# EAGLE design Grove - Joint v2.0 (EAGLE 7.1.0)
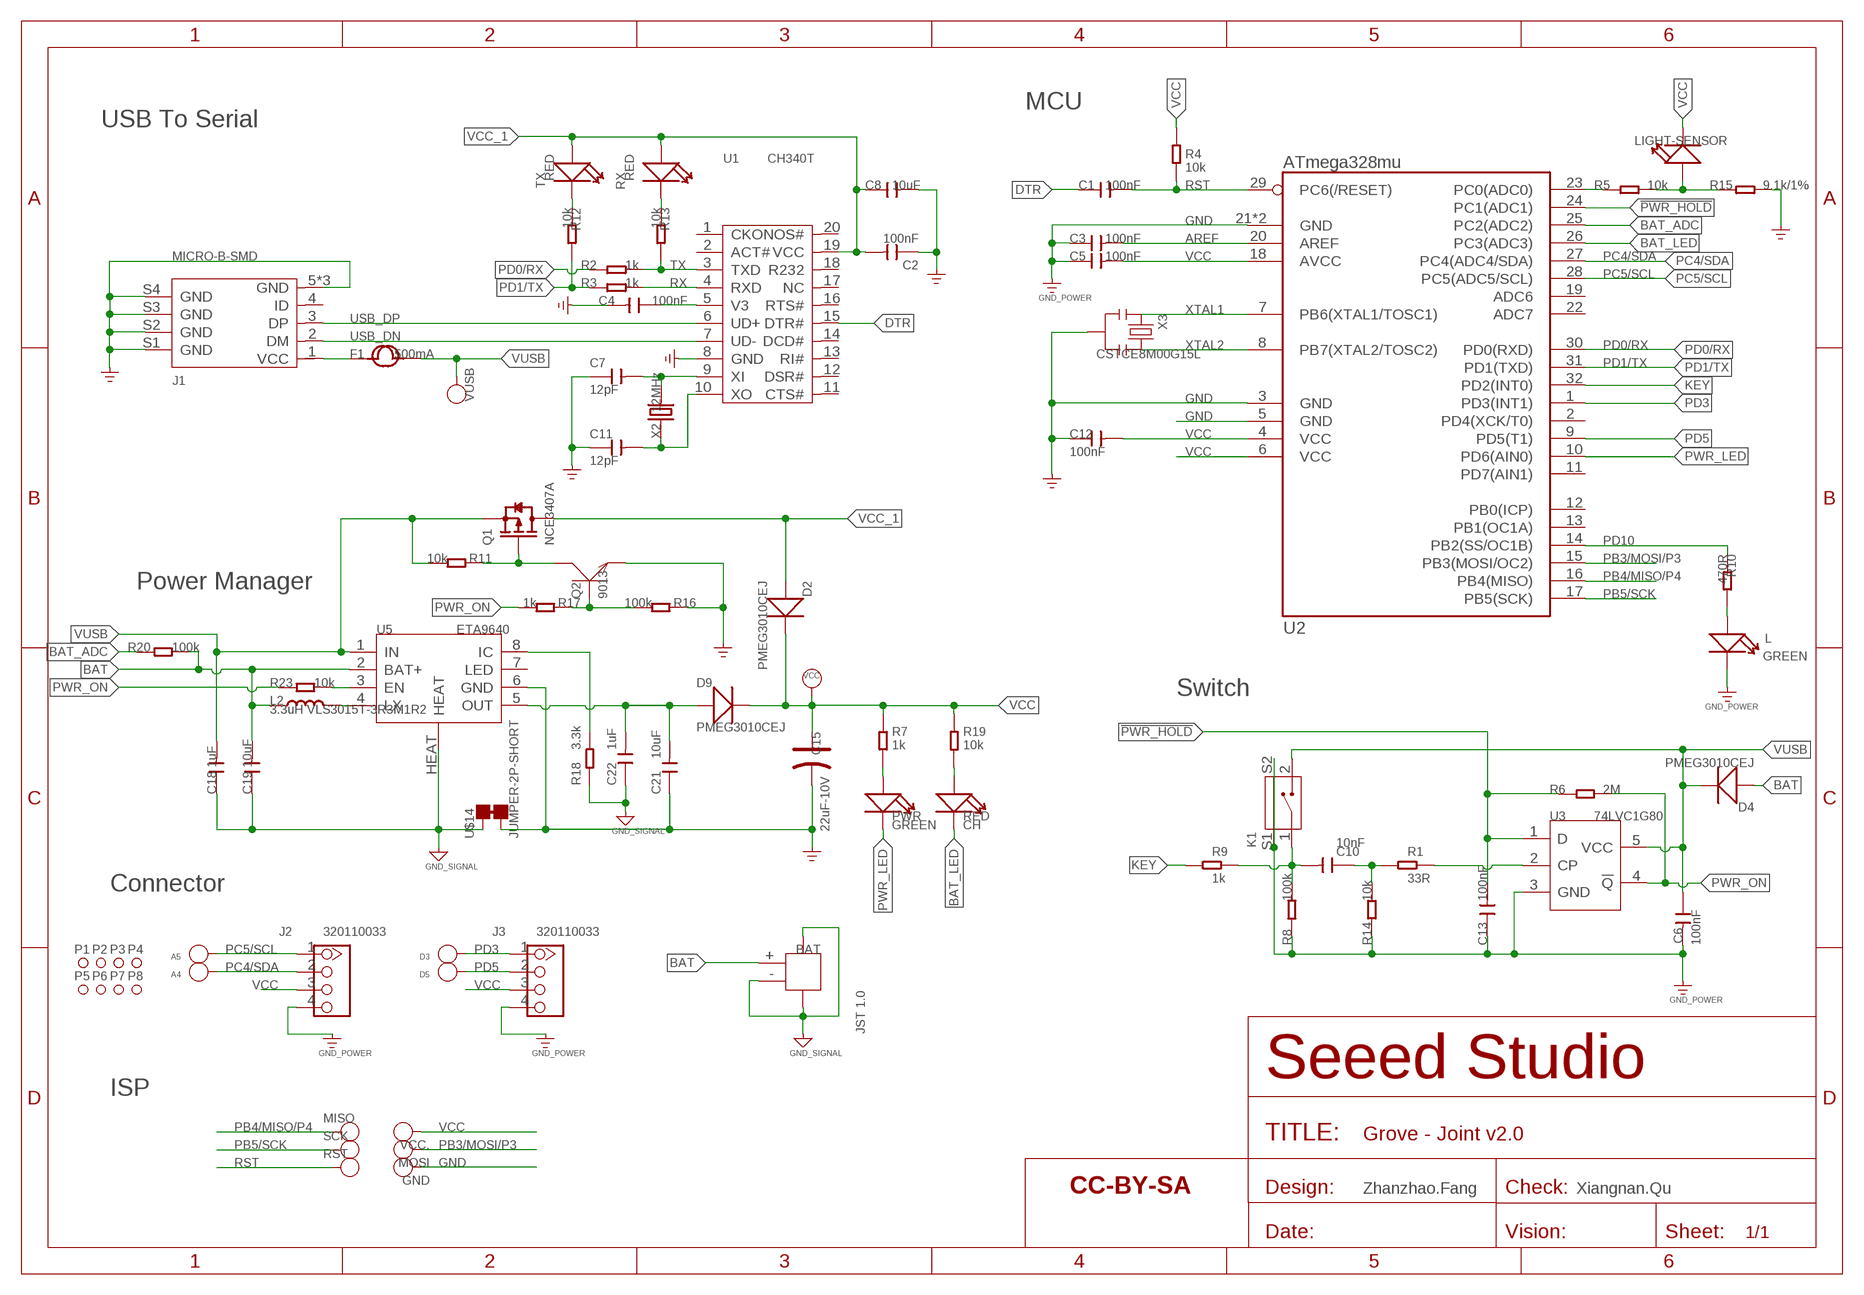
[diagram p0: schematic, sheet 1]

## Parts
A4  DNP  PAD-TEST-POINT'4545'  [TP_4545]
A5  DNP  PAD-TEST-POINT'4545'  [TP_4545]
BAT  JST 1.0  JST-2P-SMD'1.0'  [2P-SMD-1.0]
C1  100nF  CAP-0402  [C0402]
C2  100nF  CAP-0402  [C0402]
C3  100nF  CAP-0402  [C0402]
C4  100nF  CAP-0402  [C0402]
C5  100nF  CAP-0402  [C0402]
C6  100nF  CAP-0402  [C0402]
C7  12pF  CAP-0402  [C0402]
C8  10uF  CAP-0805  [C0805]
C10  10nF  CAP-0402  [C0402]
C11  12pF  CAP-0402  [C0402]
C12  100nF  CAP-0402  [C0402]
C13  100nF  CAP-0402  [C0402]
C15  22uF-10V  CAP-POLAR-AVX-A  [AVX-A]
C18  1uF  CAP-0805  [C0805]
C19  10uF  CAP-0805  [C0805]
C21  10uF  CAP-0805  [C0805]
C22  1uF  CAP-0603  [C0603]
CH  RED  LED'0402'  [LED-0402]
D2  PMEG3010CEJ  DIODE'0805'  [SOD-323]
D3  DNP  PAD-TEST-POINT'4545'  [TP-D45MIL]
D4  PMEG3010CEJ  DIODE'0805'  [SOD-323]
D5  DNP  PAD-TEST-POINT'4545'  [TP_4545]
D9  PMEG3010CEJ  DIODE'0805'  [SOD-323]
F1  500mA  FUSE'1206'  [F1206]
GND  DNP  PAD-TEST-POINT'4545'  [TP-D45MIL]
J1  MICRO-B-SMD  USB-MICRO-5P'5+4P'  [5+4P-SMD-0.65-B]
J2  320110033  GROVE-CONNECTOR-DIP-2.0  [4P-2.0]
J3  320110033  GROVE-CONNECTOR-DIP-2.0  [4P-2.0]
K1  311020023  BUTTON-2+2P'TS-1188E'  [4P-SMD-L7.0*W3.5*H3.5MM-90D]
L  GREEN  LED'0402'  [LED-0402]
L2  3.3uH VLS3015T-3R3M1R2  L'SLW3015S220MST'  [L3015]
LIGHT-SENSOR  light_sensor  LED'0805'  [LED-0805]
MISO  DNP  PAD-TEST-POINT'4545'  [TP-D45MIL]
MOSI  DNP  PAD-TEST-POINT'4545'  [TP-D45MIL]
P1  PAD-MARK'ANNULAR'  [ROUND-MARK-1.0]
P2  PAD-MARK'ANNULAR'  [ROUND-MARK-1.0]
P3  PAD-MARK'ANNULAR'  [ROUND-MARK-1.0]
P4  PAD-MARK'ANNULAR'  [ROUND-MARK-1.0]
P5  PAD-MARK'ANNULAR'  [ROUND-MARK-1.0]
P6  PAD-MARK'ANNULAR'  [ROUND-MARK-1.0]
P7  PAD-MARK'ANNULAR'  [ROUND-MARK-1.0]
P8  PAD-MARK'ANNULAR'  [ROUND-MARK-1.0]
PWR  GREEN  LED'0402'  [LED-0402]
Q1  NCE3407A  MOSFET-P'SI2323CDS/SI2305DS<BR>'  [SOT-23]
Q2  9013  TRANSISTOR-NPN-SOT323  [SOT-323]
R1  33R  RES-0402  [R0402]
R2  1k  RES-0402  [R0402]
R3  1k  RES-0402  [R0402]
R4  10k  RES-0402  [R0402]
R5  10k  RES-0402  [R0402]
R6  2M  RES-0402  [R0402]
R7  1k  RES-0402  [R0402]
R8  100k  RES-0402  [R0402]
R9  1k  RES-0402  [R0402]
R10  470R  RES-0402  [R0402]
R11  10k  RES-0402  [R0402]
R12  10k  RES-0402  [R0402]
R13  10k  RES-0402  [R0402]
R14  10k  RES-0402  [R0402]
R15  9.1k/1%  RES-0402  [R0402]
R16  100k  RES-0402  [R0402]
R17  1k  RES-0402  [R0402]
R18  3.3k  RES-0402  [R0402]
R19  10k  RES-0402  [R0402]
R20  100k  RES-0402  [R0402]
R23  10k  RES-0402  [R0402]
RST  DNP  PAD-TEST-POINT'4545'  [TP-D45MIL]
RX  RED  LED'0402'  [LED-0402]
SCK  DNP  PAD-TEST-POINT'4545'  [TP-D45MIL]
TX  RED  LED'0402'  [LED-0402]
U1  CH340T  [SSOP20]
U2  ATmega328mu  ATMEGA8/168/328MLF  [MLF32X-W/HEAT]
U3  74LVC1G80  [SOT-753]
U5  ETA9640  [SOP8-W/HEAT]
U$4  SEEEDSTUDIO-OPEN-SCH-FRAME  [SEEEDSTUDIO-PCB-FRAME]
U$14  JUMPER-2P-SHORT  [2P-SMD-SHORT]
VCC  NC  PAD-TEST-POINT'4545'  [TP-D45MIL]
VCC.  NC  PAD-TEST-POINT'4545'  [TP-D45MIL]
VUSB  PAD-TEST-POINT'4545'  [TP-D45MIL]
X2  12MHz  CRYSTAL'5032'  [2P-SMD-L5.0XW3.2MM]
X3  CSTCE8M00G15L  CRYSTAL-RESONATOR'SMD'  [3P-SMD-L3.6*W1.3MM]

## Nets
!PWR_HOLD: C13.2 R6.1 U2.24(PC1(ADC1)) U3.1(D)
AGND: BAT.3 BAT.4 BAT.- C18.1 C19.1 C22.1 R18.2 U5.HEAT U$14.1 ; supply symbol labelled GND_SIGNAL
AREF: C3.2 U2.20(AREF)
BAT: BAT.+ C19.2 D4.+ L2.1 R20.2 U5.2(BAT+)
BAT_ADC: R20.1 U2.25(PC2(ADC2))
BAT_LED: CH.- U2.26(PC3(ADC3))
BOOST: C21.2 C22.2 D9.+ U5.5(OUT)
DTR: C1.1 U1.15(DTR#)
GND: C2.1 C3.1 C4.2 C5.1 C6.2 C7.1 C8.2 C11.1 C12.1 C13.1 C15.- C21.1 GND.T J1.5(GND) J1.S1(GND) J1.S2(GND) J1.S3(GND) J1.S4(GND) J1.S5(GND) J1.S6(GND) J2.4 J3.4 K1.S1 K1.S2 L.- Q2.2(E) R8.1 R14.1 R15.2 R16.2 U1.8(GND) U2.3(GND) U2.5(GND) U2.21(GND) U2.HEAT(GND) U3.3(GND) U5.6(GND) U$14.2 X3.2 ; supply symbol labelled GND_POWER
KEY: R9.1 U2.32(PD2(INT0))
N$1: C10.1 R1.1 R14.2
N$2: L.+ R10.2
N$3: LIGHT-SENSOR.+ R5.2 R15.1
N$4: CH.+ R19.1
N$5: C10.2 K1.1 R8.2 R9.2
N$6: R5.1 U2.23(PC0(ADC0))
N$7: R23.2 U5.3(EN)
N$8: R12.1 TX.-
N$9: R13.1 RX.-
N$10: C7.2 U1.9(XI) X2.2
N$11: R1.2 U3.2(CP)
N$12: Q1.1(G) Q2.3(C) R11.2
N$13: PWR.+ R7.2
N$14: C11.2 U1.10(XO) X2.1
N$15: Q2.1(B) R16.1 R17.2
N$16: R18.1 U5.8(IC)
N$17 [usbvcc]: F1.1 J1.1(VCC)
N$20: L2.2 U5.4(LX)
PB3/MOSI/P3: MOSI.T U2.15(PB3(MOSI/OC2))
PB4/MISO/P4: MISO.T U2.16(PB4(MISO))
PB5/SCK: SCK.T U2.17(PB5(SCK))
PC4/SDA: A4.T J2.2 U2.27(PC4(ADC4/SDA))
PC5/SCL: A5.T J2.1 U2.28(PC5(ADC5/SCL))
PD0/RX: R2.1 U2.30(PD0(RXD))
PD1/TX: R3.1 R12.2 U2.31(PD1(TXD))
PD3: D3.T J3.1 U2.1(PD3(INT1))
PD5: D5.T J3.2 U2.9(PD5(T1))
PD10: R10.1 U2.14(PB2(SS/OC1B))
PWR_LED: PWR.- U2.10(PD6(AIN0))
PWR_ON: R6.2 R17.1 R23.1 U3.4(!Q)
RST: C1.2 R4.1 RST.T U2.29(PC6(/RESET))
RX: R3.2 U1.4(RXD)
TX: R2.2 R13.2 U1.3(TXD)
USB_DN: J1.2(DM) U1.7(UD-)
USB_DP: J1.3(DP) U1.6(UD+)
V3: C4.1 U1.5(V3)
VCC: C5.2 C12.2 C15.+ D2.- D9.- J2.3 J3.3 LIGHT-SENSOR.- R4.2 R7.1 R19.2 U2.4(VCC) U2.6(VCC) U2.18(AVCC) VCC..T VCC.T
VCC_1: C2.2 C8.1 D2.+ Q1.3(D) RX.+ TX.+ U1.19(VCC)
VUSB: C6.1 C18.2 D4.- F1.2 K1.2 Q1.2(S) R11.1 U3.5(VCC) U5.1(IN) VUSB.T
XTAL1: U2.7(PB6(XTAL1/TOSC1)) X3.1
XTAL2: U2.8(PB7(XTAL2/TOSC2)) X3.3
Unconnected: J1.4(ID) U1.1(CKO) U1.2(ACT#) U1.11(CTS#) U1.12(DSR#) U1.13(RI#) U1.14(DCD#) U1.16(RTS#) U1.17(NC) U1.18(R232) U1.20(NOS#) U2.2(PD4(XCK/T0)) U2.11(PD7(AIN1)) U2.12(PB0(ICP)) U2.13(PB1(OC1A)) U2.19(ADC6) U2.22(ADC7) U5.7(LED)

## Notes on the sheet
- MCU
- USB To Serial
- Power Manager
- Switch
- Connector
- ISP
- Zhanzhao.Fang | Xiangnan.Qu

## Library data of the parts
A4 A5 D5 = Discrete:PAD-TEST-POINT; PARTNO: DNP
BAT = template:JST-2P-SMD: 2P-SMD-1.0-90D:320110054;2P-SMD-2.0-90D:320110026
C1-C8 C10-C13 C18 C19 C21 C22 = Discrete-new:CAP: Ceramic Capacitors
C15 = Discrete-new:CAP-POLAR: Electrolytic Capacitors,Tantalum Capacitors and Super Capacitors
CH L LIGHT-SENSOR PWR RX TX = Discrete-new:LED
D2 D4 D9 = Discrete-new:DIODE*
D3 GND MISO MOSI RST SCK VCC VCC. VUSB = Discrete-new:PAD-TEST-POINT; PARTNO: DNP
F1 = Discrete-new:FUSE
J1 = Connector-new:USB-MICRO-5P: 5+4P-SMD-0.65-B:320010000;5+2P-SMD-0.65-AB:340032001
J2 J3 = Connector-new:GROVE-CONNECTOR-DIP: 4P-2.0:320110033;4P-2.0-90D:320110034
K1 = Discrete-new:BUTTON-2+2P: 4P-SMD-L4.5*W3.8*H1.8MM-90D:311020035;4P-SMD-L7.0*W3.5*H3.5MM-90D:311020023
L2 = template:L
P1-P8 = Discrete-new:PAD-MARK; PARTNO: DNP
Q1 = Discrete-new:MOSFET-P
Q2 = Discrete-new:TRANSISTOR-NPN*: NPN audion
R1-R20 R23 = Discrete-new:RES
U1 = template:CH340T
U2 = IC:ATMEGA8/168/328: MICROCONTROLLER
U3 = template:74LVC1G80: Single D-type flip-flop; positive-edge trigger
U5 = template:ETA9640: 5V/1A Synchronous Boost with 1A Linear Charger for Power Bank
U$4 = moudle-new:SEEEDSTUDIO-OPEN-SCH-FRAME
U$14 = Discrete-new:JUMPER-2P-SHORT
X2 = Discrete-new:CRYSTAL
X3 = Discrete-new:CRYSTAL-RESONATOR: Resonator Small SMD resonator. This is the itty bitty 10/20MHz resonators with built in caps. CSTCE10M0G55 and CSTCE20M0V53. Footprint has been reviewed closely but hasn't been tested yet.

## Net classes
0 default: width 0.102 mm, drill 0.203 mm, clearance 0.102 mm
3 usbvcc: width 0.203 mm, drill 0.305 mm, clearance 0.203 mm

## Board
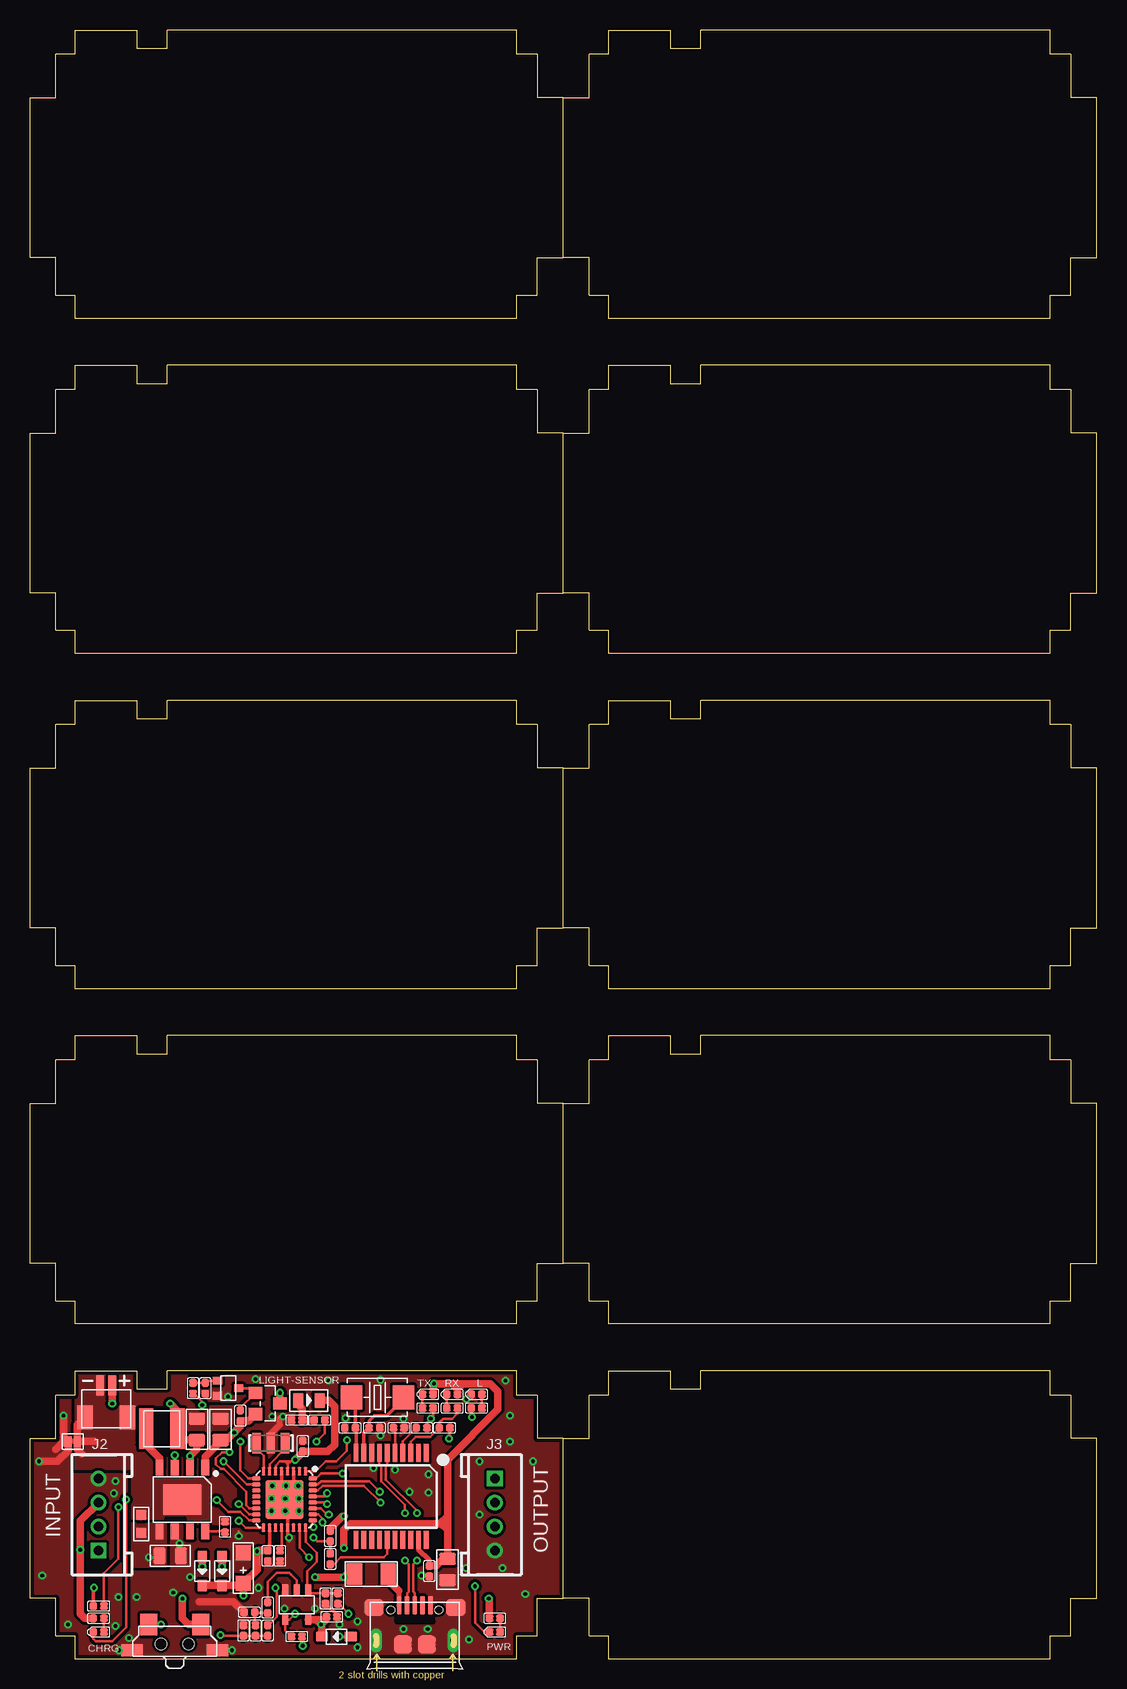
[diagram p1: board, top side]
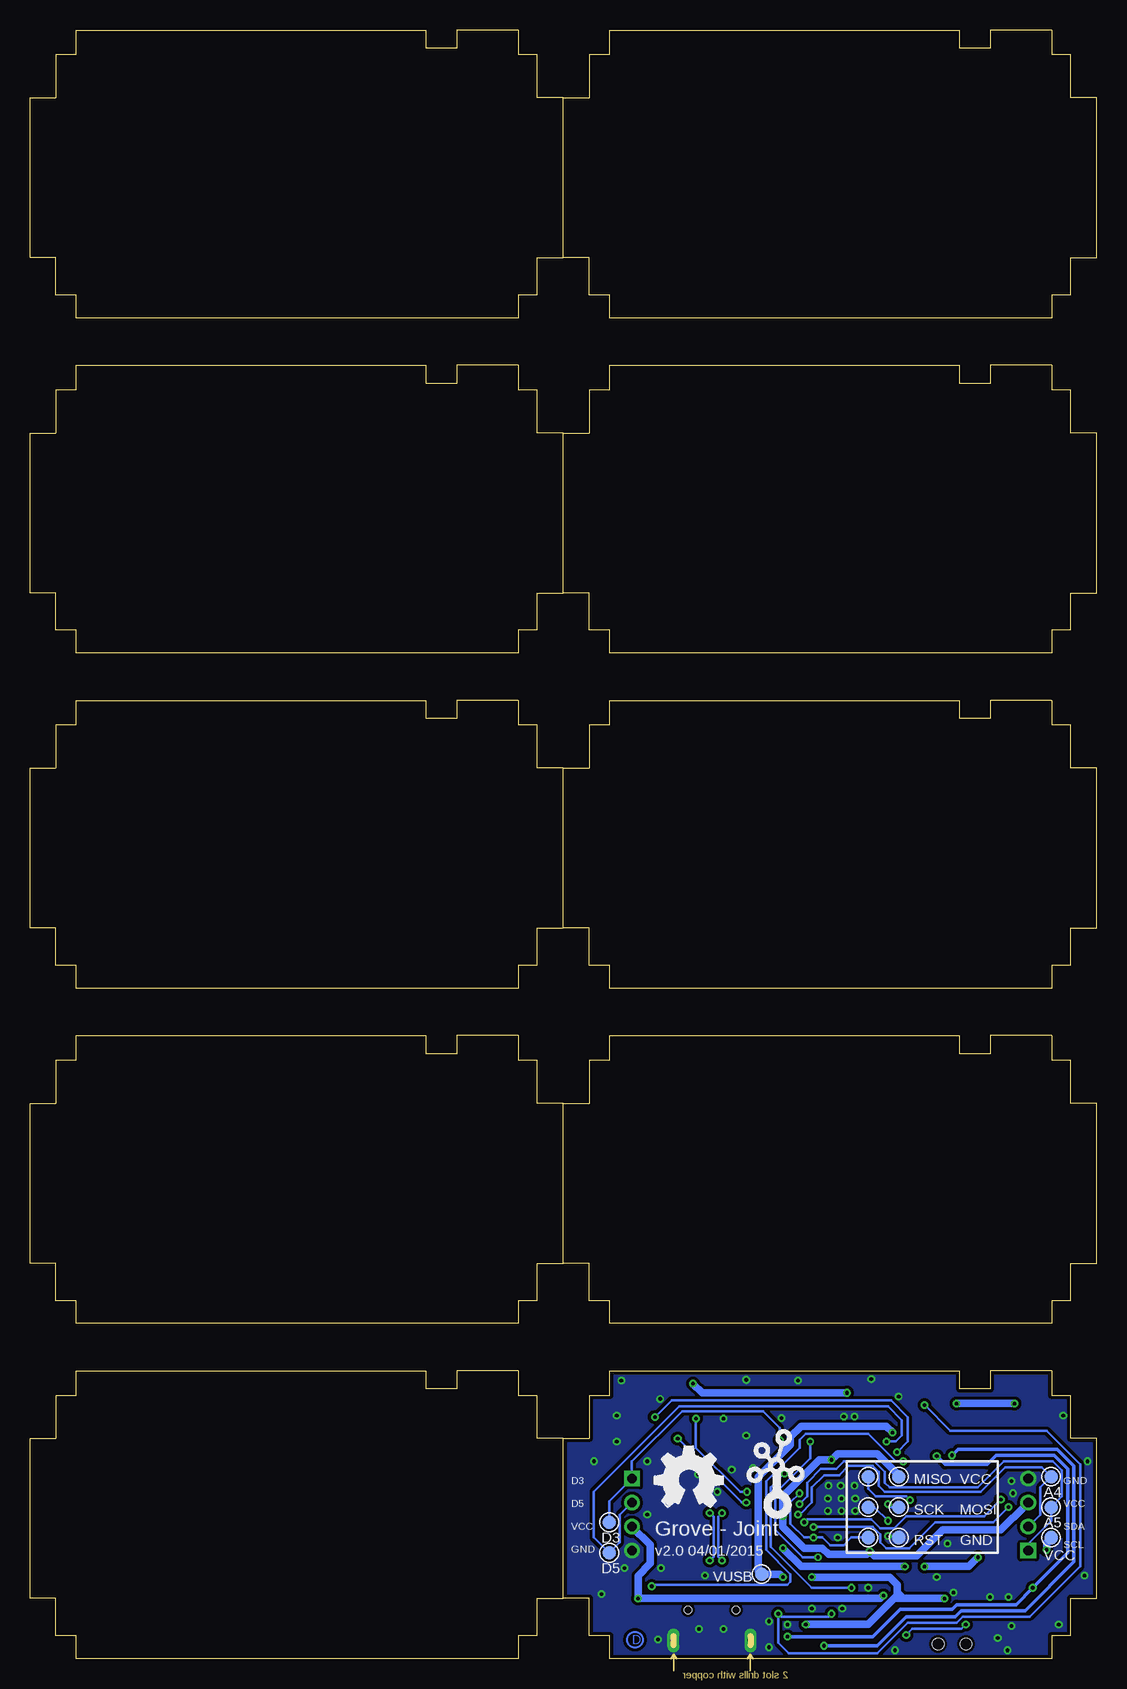
[diagram p2: board, bottom side, seen from below]

Size 88.9 x 135.76 mm. Coordinates in mm from the lower left corner, seen from the top.
Outline: 44.45,5.02 42.29,5.02 42.29,1.9 40.58,1.9 40.58,0 3.75,0 3.75,1.9 2.16,1.9 2.16,5.02 0,5.02 0,18.35 2.16,18.35 2.16,21.97 3.75,21.97 3.75,24 8.89,24 8.89,22.48 11.43,22.48 11.43,24 40.58,24 40.58,21.97 42.29,21.97 42.29,18.35 44.45,18.35
Outline: 44.45,5.02 46.61,5.02 46.61,1.9 48.2,1.9 48.2,0 85.03,0 85.03,1.9 86.74,1.9 86.74,5.02 88.9,5.02 88.9,18.35 86.74,18.35 86.74,21.97 85.03,21.97 85.03,24 55.88,24 55.88,22.48 53.34,22.48 53.34,24 48.2,24 48.2,21.97 46.61,21.97 46.61,18.35 44.45,18.35
Outline: 44.45,5.02 44.45,18.35
Outline: 44.45,32.96 42.29,32.96 42.29,29.84 40.58,29.84 40.58,27.94 3.75,27.94 3.75,29.84 2.16,29.84 2.16,32.96 0,32.96 0,46.29 2.16,46.29 2.16,49.91 3.75,49.91 3.75,51.94 8.89,51.94 8.89,50.42 11.43,50.42 11.43,51.94 40.58,51.94 40.58,49.91 42.29,49.91 42.29,46.29 44.45,46.29
Outline: 44.45,32.96 46.61,32.96 46.61,29.84 48.2,29.84 48.2,27.94 85.03,27.94 85.03,29.84 86.74,29.84 86.74,32.96 88.9,32.96 88.9,46.29 86.74,46.29 86.74,49.91 85.03,49.91 85.03,51.94 55.88,51.94 55.88,50.42 53.34,50.42 53.34,51.94 48.2,51.94 48.2,49.91 46.61,49.91 46.61,46.29 44.45,46.29
Outline: 44.45,32.96 44.45,46.29
Outline: 44.45,60.9 42.29,60.9 42.29,57.78 40.58,57.78 40.58,55.88 3.75,55.88 3.75,57.78 2.16,57.78 2.16,60.9 0,60.9 0,74.23 2.16,74.23 2.16,77.85 3.75,77.85 3.75,79.88 8.89,79.88 8.89,78.36 11.43,78.36 11.43,79.88 40.58,79.88 40.58,77.85 42.29,77.85 42.29,74.23 44.45,74.23
Outline: 44.45,60.9 46.61,60.9 46.61,57.78 48.2,57.78 48.2,55.88 85.03,55.88 85.03,57.78 86.74,57.78 86.74,60.9 88.9,60.9 88.9,74.23 86.74,74.23 86.74,77.85 85.03,77.85 85.03,79.88 55.88,79.88 55.88,78.36 53.34,78.36 53.34,79.88 48.2,79.88 48.2,77.85 46.61,77.85 46.61,74.23 44.45,74.23
Outline: 44.45,60.9 44.45,74.23
Outline: 44.45,88.84 42.29,88.84 42.29,85.73 40.58,85.73 40.58,83.82 3.75,83.82 3.75,85.73 2.16,85.73 2.16,88.84 0,88.84 0,102.17 2.16,102.17 2.16,105.79 3.75,105.79 3.75,107.82 8.89,107.82 8.89,106.3 11.43,106.3 11.43,107.82 40.58,107.82 40.58,105.79 42.29,105.79 42.29,102.17 44.45,102.17
Outline: 44.45,88.84 46.61,88.84 46.61,85.73 48.2,85.73 48.2,83.82 85.03,83.82 85.03,85.73 86.74,85.73 86.74,88.84 88.9,88.84 88.9,102.17 86.74,102.17 86.74,105.79 85.03,105.79 85.03,107.82 55.88,107.82 55.88,106.3 53.34,106.3 53.34,107.82 48.2,107.82 48.2,105.79 46.61,105.79 46.61,102.17 44.45,102.17
Outline: 44.45,88.84 44.45,102.17
Outline: 44.45,116.78 42.29,116.78 42.29,113.66 40.58,113.66 40.58,111.76 3.75,111.76 3.75,113.66 2.16,113.66 2.16,116.78 0,116.78 0,130.11 2.16,130.11 2.16,133.73 3.75,133.73 3.75,135.76 8.89,135.76 8.89,134.24 11.43,134.24 11.43,135.76 40.58,135.76 40.58,133.73 42.29,133.73 42.29,130.11 44.45,130.11
Outline: 44.45,116.78 46.61,116.78 46.61,113.66 48.2,113.66 48.2,111.76 85.03,111.76 85.03,113.66 86.74,113.66 86.74,116.78 88.9,116.78 88.9,130.11 86.74,130.11 86.74,133.73 85.03,133.73 85.03,135.76 55.88,135.76 55.88,134.24 53.34,134.24 53.34,135.76 48.2,135.76 48.2,133.73 46.61,133.73 46.61,130.11 44.45,130.11
Outline: 44.45,116.78 44.45,130.11
Copper layers (1*16): Top 0.035mm / dielectric 1.5mm / Bottom 0.035mm
Design rules "SeeedStudio_2layer_DRU_no_angle_20140221 *": minimum track width 6mil, minimum drill 12mil, track to track 6mil, track to pad 6mil, pad to pad 6mil, via to via 6mil, smd to smd 0mil, copper to edge 10mil, drill to drill 10mil, minimum pad ring 10mil, minimum via ring 6mil, stop-mask expansion 2mil, vias tented up to drill 25mil, thermal gap 10mil
Holes 2 mm at -4.45,133.92 -4.45,1.84 93.34,133.92 93.34,1.84
tRestrict: area 9,17.8 to 12.1,20.8; area 11.4,11.5 to 12.8,11.6

### Footprints (pad centres in the part's own frame; a part is rotated, then mirrored left to right if it is on the bottom)
TP_4545 = smd 1.143 x 1.143: T 0,0
2P-SMD-1.0 = smd 1.3 x 2: 3 1.778,3.556; 4 -1.778,3.556 | smd 0.635 x 1.651: + -0.508,0.889; - 0.508,0.889
C0402 = smd 0.635 x 0.635: 1 0,0.445; 2 0,-0.445
C0805 = smd 1.397 x 1.016: 1 0,0.889; 2 0,-0.889
AVX-A = smd 1.27 x 1.27: + -1.27,0; - 1.27,0
C0603 = smd 0.889 x 0.889: 1 0,0.762; 2 0,-0.762
LED-0402 = smd 0.635 x 0.635: + -0.445,0; - 0.445,0
SOD-323 = smd 1 x 0.8: + -1.2,0; - 1.2,0
TP-D45MIL = smd 1.143 x 1.143: T 0,0
F1206 = smd 1.27 x 1.778: 1 -1.397,0; 2 1.397,0
5+4P-SMD-0.65-B = smd 0.381 x 1.524: 1 -1.3,-0.25; 2 -0.65,-0.25; 3 0,-0.25; 4 0.65,-0.25; 5 1.3,-0.25 | smd 1.6 x 1.397: S1 -3.4,-0.427; S6 3.4,-0.427 | drill 0.508 pad 1.016 long: S2 -3.226,-3.175; S5 3.226,-3.175 | smd 1.5 x 1.5: S3 -1,-3.5; S4 1,-3.5 | hole 0.635: -2,-0.65; 2,-0.65
4P-2.0 = drill 0.8 pad 1.27 square: 1 -3,0 | drill 0.8 pad 1.27: 2 -1,0; 3 1,0; 4 3,0
4P-SMD-L7.0*W3.5*H3.5MM-90D = smd 1.397 x 1.778: 1 -2.159,1.651; 2 2.159,1.651 | smd 1.778 x 1.016: S1 -3.556,-0.508; S2 3.556,-0.508 | hole 0.95: -1.15,0; 1.15,0
L3015 = smd 1.2 x 3.4: 1 -1.3,0; 2 1.3,0
LED-0805 = smd 0.889 x 1.27: + -0.889,0; - 0.889,0
ROUND-MARK-1.0 = smd 1.016 x 1.016: P$1 0,0
SOT-23 = smd 1.016 x 1.143: 1 -0.889,-1.016; 2 0.889,-1.016; 3 0,1.016
SOT-323 = smd 0.635 x 0.762: 1 -0.635,-0.889; 2 0.635,-0.889; 3 0,0.889
R0402 = smd 0.635 x 0.635: 1 0,0.445; 2 0,-0.445
SSOP20 = smd 0.4 x 1.5: 1 -2.925,-3.625; 2 -2.275,-3.625; 3 -1.625,-3.625; 4 -0.975,-3.625; 5 -0.325,-3.625; 6 0.325,-3.625; 7 0.975,-3.625; 8 1.625,-3.625; 9 2.275,-3.625; 10 2.925,-3.625; 11 2.925,3.625; 12 2.275,3.625; 13 1.625,3.625; 14 0.975,3.625; 15 0.325,3.625; 16 -0.325,3.625; 17 -0.975,3.625; 18 -1.625,3.625; 19 -2.275,3.625; 20 -2.925,3.625
MLF32X-W/HEAT = smd 0.7 x 0.3: 1 -2.35,1.75; 2 -2.35,1.25; 3 -2.35,0.75; 4 -2.35,0.25; 5 -2.35,-0.25; 6 -2.35,-0.75; 7 -2.35,-1.25; 8 -2.35,-1.75; 17 2.35,-1.75; 18 2.35,-1.25; 19 2.35,-0.75; 20 2.35,-0.25; 21 2.35,0.25; 22 2.35,0.75; 23 2.35,1.25; 24 2.35,1.75 | smd 0.3 x 0.7: 9 -1.75,-2.35; 10 -1.25,-2.35; 11 -0.75,-2.35; 12 -0.25,-2.35; 13 0.25,-2.35; 14 0.75,-2.35; 15 1.25,-2.35; 16 1.75,-2.35; 25 1.75,2.35; 26 1.25,2.35; 27 0.75,2.35; 28 0.25,2.35; 29 -0.25,2.35; 30 -0.75,2.35; 31 -1.25,2.35; 32 -1.75,2.35 | smd 3.175 x 3.175: HEAT 0,0
SOT-753 = smd 0.5 x 0.9: 1 -0.95,-1.25; 2 0,-1.25; 3 0.95,-1.25; 4 0.95,1.25; 5 -0.95,1.25
SOP8-W/HEAT = smd 0.635 x 1.27: 1 -1.905,-2.667; 2 -0.635,-2.667; 3 0.635,-2.667; 4 1.905,-2.667; 5 1.905,2.667; 6 0.635,2.667; 7 -0.635,2.667; 8 -1.905,2.667 | smd 3.175 x 2.54: HEAT 0,0
2P-SMD-SHORT = smd 0.889 x 0.61: 1 0,0.381; 2 0,-0.381
2P-SMD-L5.0XW3.2MM = smd 1.778 x 2.032: 1 -2.159,0; 2 2.159,0
3P-SMD-L3.6*W1.3MM = smd 0.7 x 1.7: 1 -1.2,0; 2 0,0; 3 1.2,0

### Placement (x,y rotation side)
A4  3.81,15.18 270 bottom
A5  3.81,12.64 270 bottom
BAT  6.35,23.69 180 top
C1  25.02,8.32 180 top
C2  33.27,7.3 180 top
C3  20.83,8.57 180 top
C4  30.73,19.24 90 top
C5  19.81,8.57 180 top
C6  25.15,3.49 90 top
C7  28.7,19.24 270 top
C8  34.8,7.43 0 top
C10  18.8,2.35 0 top
C11  26.67,19.24 90 top
C12  22.73,17.72 0 top
C13  24.64,5.02 180 top
C15  17.78,7.56 90 top
C18  15.88,19.11 0 top
C19  13.91,19.11 0 top
C21  11.68,8.57 270 top
C22  9.27,11.24 0 top
CH  5.71,2.22 180 top
D2  16,7.3 270 top
D3  40.64,11.37 270 bottom
D4  25.53,1.84 180 top
D5  40.64,8.83 270 bottom
D9  14.35,7.3 270 top
F1  28.45,7.05 180 top
GND  16.51,10.1 0 bottom
J1  32.07,4.7 0 top
J2  5.71,12 90 top
J3  38.73,12 270 top
K1  12.07,1.21 0 top
L  37.21,22.03 180 top
L2  10.99,19.18 180 top
LIGHT-SENSOR  23.24,21.53 0 top
MISO  19.05,15.18 0 bottom
MOSI  16.51,12.64 0 bottom
P1  93.34,6.92 180 top  (outside the outline)
P2  93.34,6.92 180 bottom  (outside the outline)
P3  -4.45,9.46 180 top  (outside the outline)
P4  -4.45,9.46 180 bottom  (outside the outline)
P5  93.34,128.84 270 top  (outside the outline)
P6  93.34,128.84 90 bottom  (outside the outline)
P7  -4.45,128.84 270 top  (outside the outline)
P8  -4.45,128.84 90 bottom  (outside the outline)
PWR  38.73,2.22 180 top
Q1  19.81,21.27 270 top
Q2  16.51,22.54 270 top
R1  19.81,4.25 180 top
R2  34.54,19.24 270 top
R3  32.64,19.24 270 top
R4  25.02,10.22 180 top
R5  24.13,19.88 270 top
R6  25.65,5.02 0 top
R7  38.73,3.37 90 top
R8  17.78,2.35 0 top
R9  19.81,2.35 0 top
R10  37.21,20.89 90 top
R11  17.53,20.26 180 top
R12  33.15,20.89 90 top
R13  35.18,20.89 90 top
R14  18.29,3.87 90 top
R15  22.23,19.88 270 top
R16  14.61,22.54 0 top
R17  13.59,22.54 180 top
R18  16.26,10.99 180 top
R19  5.71,3.37 270 top
R20  5.71,4.38 270 top
R23  22.23,1.84 90 top
RST  19.05,10.1 0 bottom
RX  35.18,22.03 180 top
SCK  19.05,12.64 0 bottom
TX  33.15,22.03 180 top
U1  30.1,13.53 180 top
U2  21.21,13.27 270 top
U3  22.23,4.51 180 top
U5  12.7,13.27 180 top
U$2  [OSHW_FILLX200_NOTEXT]  36.83,12.64 0 bottom
U$3  [TWIGLOGO]  26.67,12.64 0 bottom
U$4  -8.94,-11.49 0 top  (outside the outline)
U$14  3.56,18.1 270 top
VCC  3.81,10.1 0 bottom
VCC.  16.51,15.18 0 bottom
VUSB  27.94,7.05 0 bottom
X2  28.96,21.78 0 top
X3  20.07,17.97 180 top

### Tracks (layer width: path | path; a pad name or v marks a point on that pad's centre or on a via)
!PWR_HOLD
  Top 0.203: R6.1 C13.2 23.47,5.46 U3.1 23.11,5.82 23.11,7.3 23.88,8.06 23.88,8.83 22.96,9.74 U2.24
AGND
  Top 0.61: U$14.1 5.33,18.1 | U$14.1 3.94,17.46 4.32,17.08 | U$14.1 3.94,19.49 BAT.3
  pour Top (isolate 0.254, rank 2, no thermals): 3.81,23.94 3.81,15.81 8.51,15.81 8.51,11.24 17.15,11.24 17.15,21.02 13.76,21.02 13.08,21.7 13.08,23.94
AREF
  Top 0.203: U2.20 20.96,9.15 C3.2
BAT  (via drill 0.3 pad 0.64)
  Top 0.305: D4.+ v25.78,1.84 | R20.2 5.27,5.84 v5.33,5.91
  Top 0.61: U5.2 v13.34,16.89 13.91,17.46 C19.2 12.83,18.22 12.29,18.77 L2.1 12.29,20.67 v11.68,21.27 | BAT.+ v6.86,21.27
  Bottom 0.305: v25.78,1.84 18.67,1.84 16.38,4.13 12.07,4.13 11.68,4.51 6.73,4.51 v5.33,5.91 2.41,8.83 2.41,15.81 3.56,16.95 8.38,16.95 9.14,16.19 12.64,16.19 v13.34,16.89
  Bottom 0.61: v6.86,21.27 v11.68,21.27
BAT_ADC  (via drill 0.3 pad 0.64)
  Top 0.203: U2.25 23.56,11.05 v23.62,10.99 | R20.1 6.16,7.11 7.37,8.32 v7.37,12.64
  Bottom 0.203: v23.62,10.99 18.67,10.99 18.03,10.35 18.03,9.72 17.53,9.21 15.62,9.21 13.46,11.37 8.64,11.37 v7.37,12.64
BAT_LED  (via drill 0.3 pad 0.64)
  Top 0.203: v24.38,11.37 24.38,11.65 24.01,12.02 U2.26 | CH.- 5.27,1.65 5.46,1.46 6.86,1.46 8,2.6 v8,13.27
  Bottom 0.203: v24.38,11.37 24.13,11.62 18.8,11.62 18.03,10.86 16.89,10.86 15.88,11.87 9.4,11.87 v8,13.27
BOOST  (via drill 0.3 pad 0.64)
  Top 0.61: D9.+ v14.35,7.68
  Bottom 0.61: v14.35,7.68 10.67,7.68 v9.91,8.45
  pour Top (isolate 0.254, no thermals): 11.3,11.24 8.51,11.24 8.51,7.68 11.3,7.68
DTR
  Top 0.203: U1.15 29.77,8.76 29.46,8.45 25.91,8.45 25.34,7.87 C1.1
GND  (via drill 0.3 pad 0.64)
  Top 0.203: v17.4,10.22 17.4,10.6
  Top 0.305: U2.5 20.96,14.79 v21.34,14.41 | U2.3 21.96,14.81 v22.35,14.41 | v21.27,12.32 21.46,12.13 U2.21 21.46,9.97 21.59,9.84 | C13.1 25.53,3.68 25.53,3.56 C6.2 | L.- v36.39,21.65
  Top 0.508: X3.2 20.07,18.73 20.83,19.49 20.83,20 21.08,20.26
  Top 0.61: v21.27,13.33 U2.HEAT | 14.1,4.76 16.95,4.76 R14.1 | v2.79,20.26 2.79,18.48 U$14.2 | U$14.2 3.18,17.34 2.29,16.45 v0.76,16.45 | U$14.2 2.79,18.1 2.16,17.46
  other vias: 20.19,14.41 22.42,13.34 20.13,13.34 20.13,12.32 22.42,12.32 27.3,0.95 7.37,5.14 3.18,2.86 36.32,7.56 37.47,16.45 27.3,3.11 36.58,1.59 41.91,16.45 1.02,6.92 29.21,18.61 31.62,13.91 28.64,15.88 12.45,9.59 21.59,10.1 31.12,20 39.62,23.18 8.26,1.71 37.47,12 8.89,5.14 31.12,2.48 33.15,2.48 41.28,5.4 19.05,5.91 7.11,14.8 6.99,13.78 30.42,15.75 33.21,15.37 33.21,13.84 40.01,18.1 40.01,20.26 21.08,20.19 16.51,21.84 25.78,2.86 23.75,4.19 21.21,4.19 7.11,2.73 26.29,20.07 29.21,23.24 16.83,0.7 7.43,0.7 32.64,6.92 39.37,7.56 24.89,23.18 18.8,23.3 13.34,6.79 20.19,20.19 11.94,5.52
  pour Top (isolate 0.254, rank 6, no thermals): -0.51,24.7 -0.51,-0.83 45.09,-0.83 45.09,24.7
  pour Bottom (isolate 0.254, rank 6, no thermals): -0.51,24.7 -0.51,-0.83 45.09,-0.83 45.09,24.7
KEY  (via drill 0.3 pad 0.64)
  Top 0.203: R9.1 19.88,2.79 20.57,3.49 20.57,5.78 v20.45,5.91 | U2.32 23.85,15.02 24.26,15.43 v26.04,15.43
  Bottom 0.203: v20.45,5.91 23.75,5.91 27.18,9.33 27.18,14.29 v26.04,15.43
N$1
  Top 0.203: R1.1 18.8,3.81 R14.2 18.73,2.86 C10.1
N$2
  Top 0.203: R10.2 L.+
N$3
  Top 0.61: R5.2 R15.1 22.67,20.83 22.35,21.15 LIGHT-SENSOR.+
N$4
  Top 0.203: R19.1 CH.+
N$5  (via drill 0.3 pad 0.64)
  Top 0.203: R9.2 C10.2 R8.2 15.94,1.9 v15.88,1.97 | K1.1 v10.92,2.86
  Bottom 0.203: v15.88,1.97 15.37,2.48 11.3,2.48 v10.92,2.86
N$6  (via drill 0.3 pad 0.61)
  Top 0.203: U2.23 22.46,9.23 v23.24,8.45 | R5.1 24.57,18.8 v23.88,18.1
  Bottom 0.203: v23.24,8.45 24.51,8.45 26.8,10.73 26.8,13.78 23.88,16.7 v23.88,18.1
N$7  (via drill 0.3 pad 0.64)
  Top 0.305: U5.3 v12.07,16.95 | R23.2 22.67,1.14 v22.73,1.08
  Bottom 0.305: v22.73,1.08 18.29,1.08 15.88,3.49 11.81,3.49 11.3,4 5.97,4 1.91,8.06 1.91,16.07 3.3,17.46 11.56,17.46 v12.07,16.95
N$8
  Top 0.203: R12.1 TX.-
N$9
  Top 0.203: R13.1 RX.-
N$10
  Top 0.305: U1.9 27.82,18.81 C7.2 28.26,19.81 28.7,20.26 29.72,20.26 30.67,21.21 30.73,21.27 31.12,21.65 X2.2
N$11
  Top 0.203: U3.2 22.23,6.54 21.78,6.99 21.72,7.05 21.59,7.18 20.57,7.18 19.81,6.41 R1.2
N$12
  Top 0.203: Q2.3 18.42,22.54 Q1.1 17.53,20.89 R11.2
N$13
  Top 0.203: R7.2 PWR.+
N$14
  Top 0.305: U1.10 27.17,19.18 C11.2 27.11,21.46 X2.1
N$15
  Top 0.203: R17.2 R16.1 14.8,23.18 Q2.1
N$16
  Top 0.203: U5.8 16.19,10.6 R18.1
N$17
  Top 0.406: J1.1 30.77,5.62 30.73,5.65
  Top 0.61: F1.1 29.85,6.54 30.73,5.65
N$20
  Top 0.61: U5.4 10.8,16.7 9.69,17.81 L2.2
PB3/MOSI/P3  (via drill 0.3 pad 0.64)
  Top 0.203: U2.15 18.27,12.02 v17.4,12.89
  Bottom 0.203: MOSI.T 17.15,12.64 v17.4,12.89
PB4/MISO/P4  (via drill 0.3 pad 0.64)
  Top 0.203: U2.16 18.26,11.52 17.53,12.26 16.51,12.26 v15.56,13.21
  Bottom 0.203: MISO.T 19.05,14.16 18.42,13.53 15.88,13.53 v15.56,13.21
PB5/SCK  (via drill 0.3 pad 0.64)
  Top 0.203: U2.17 17.97,10.92 v17.4,11.49
  Bottom 0.203: 19.05,12.51 SCK.T 18.54,12.64 v17.4,11.49
PC4/SDA  (via drill 0.3 pad 0.64)
  Top 0.203: U2.27 24.25,12.52 24.77,12 v24.89,12
  Bottom 0.203: v24.89,12 24.77,12 23.75,13.02 23.75,14.29 22.73,15.3 21.46,15.3 20.7,16.07 18.67,16.07 18.16,15.56 18.16,14.41 17.65,13.91 9.65,13.91 7.62,15.94 4.57,15.94 A4.T 4.7,14.29 4.7,12 5.7,11 J2.2
PC5/SCL  (via drill 0.3 pad 0.64)
  Top 0.203: U2.28 24.63,13.02 v24.77,12.89
  Bottom 0.203: v24.77,12.89 24.13,13.53 24.13,14.67 22.99,15.81 21.72,15.81 21.08,16.45 18.54,16.45 17.65,15.56 17.65,14.67 17.27,14.29 9.91,14.29 7.75,16.45 3.68,16.45 2.92,15.68 2.92,13.53 A5.T 3.81,11.49 5.71,9.59 J2.1
PD0/RX  (via drill 0.3 pad 0.64)
  Top 0.203: U2.30 23.99,14.02 24.38,14.41 27.81,14.41 v29.21,13.02 | R2.1 34.99,18.41 v34.92,18.35
  Bottom 0.203: v34.92,18.35 29.59,13.02 v29.21,13.02
PD1/TX  (via drill 0.3 pad 0.64)
  Top 0.203: U2.31 23.98,14.52 24.26,14.8 28.26,14.8 v29.15,13.91 | R3.1 33.08,19.69 v33.4,20 33.59,20.19 R12.2
  Bottom 0.203: v29.15,13.91 29.72,13.91 33.4,17.59 v33.4,20
PD3  (via drill 0.3 pad 0.64)
  Top 0.203: U2.1 23.81,15.62 24.64,16.45 25.53,16.45 26.42,17.34 v26.42,18.22
  Bottom 0.203: v26.42,18.22 26.42,19.24 27.81,20.64 34.54,20.64 38.73,16.45 J3.1 40.64,13.1 D3.T
PD5  (via drill 0.3 pad 0.64)
  Top 0.203: U2.9 18.18,15.02 18.18,15.03 17.53,15.68 v17.53,18.1
  Bottom 0.203: v17.53,18.1 16.76,18.1 16.26,18.61 16.26,19.88 17.4,21.02 34.8,21.02 41.91,13.91 41.91,10.1 D5.T 39.75,9.72 39.75,12 38.75,13 J3.2
PD10  (via drill 0.3 pad 0.64)
  Top 0.203: U2.14 18.28,12.52 18.03,12.76 18.03,13.91 16.13,15.81 15.88,15.81 15.49,16.19 15.49,16.7 16,17.21 v16.64,17.21 | R10.1 36.77,20.19 v36.83,20.13
  Bottom 0.203: v36.83,20.13 35.43,21.53 17.15,21.53 15.75,20.13 15.75,18.1 v16.64,17.21
PWR_LED  (via drill 0.3 pad 0.64)
  Top 0.203: v37.08,6.03 37.08,2.98 37.85,2.22 PWR.- | U2.10 18.05,14.52 v16.13,16.45
  Bottom 0.203: v37.08,6.03 36.96,6.16 25.78,6.16 25.53,6.41 25.53,7.05 27.56,9.08 27.56,14.8 24.77,17.59 24.77,18.22 24.26,18.73 19.05,18.73 16.76,16.45 v16.13,16.45
PWR_ON  (via drill 0.3 pad 0.64)
  Top 0.203: R23.1 21.28,2.35 U3.4 21.61,3.26 v22.1,3.75 | R6.2 25.72,4.57 v26.54,3.75 | v14.35,21.15 14.35,21.4 13.65,22.1 R17.1
  Bottom 0.203: v22.1,3.75 22.35,3.49 26.29,3.49 v26.54,3.75 26.54,1.33 25.65,0.44 18.29,0.44 15.75,2.98 11.68,2.98 11.18,3.49 5.59,3.49 1.4,7.68 1.4,16.19 4.19,18.99 12.19,18.99 v14.35,21.15
RST  (via drill 0.3 pad 0.64)
  Top 0.203: C1.2 R4.1 23.94,9.78 v23.62,10.1 | U2.29 24.51,13.52 v24.77,13.78
  Bottom 0.203: RST.T 20.45,10.1 21.08,9.46 22.23,9.46 22.86,10.1 v23.62,10.1 24.38,10.1 25.53,11.24 25.53,13.02 v24.77,13.78
RX
  Top 0.203: R3.2 31.07,18.12 U1.4
TX
  Top 0.203: U1.3 31.72,18.07 32.13,18.48 33.34,18.48 R2.2 34.1,19.69 34.42,20 35.18,20 35.62,20.45 R13.2
USB_DN  (via drill 0.3 pad 0.64)
  Top 0.203: J1.2 31.42,5.45 31.57,5.59 31.57,7.87 v31.24,8.19 | U1.7 29.12,16.28 29.27,16.13 29.27,14.8 31.24,12.83 v31.24,12.13
  Bottom 0.203: v31.24,8.19 31.56,8.51 31.56,11.81 v31.24,12.13
USB_DP  (via drill 0.3 pad 0.64)
  Top 0.203: J1.3 32.07,5.46 31.92,5.6 31.92,7.86 v32.26,8.19 | U1.6 29.77,16.25 29.65,16.13 29.65,14.92 32.26,12.32 v32.26,12.13
  Bottom 0.203: v32.26,8.19 31.94,8.51 31.94,11.81 v32.26,12.13
V3
  Top 0.203: U1.5 30.42,19.11 C4.1
VCC  (via drill 0.3 pad 0.61, 0.3 pad 0.64)
  Top 0.203: U2.6 20.46,16.1 20.81,16.45 21.21,16.45 | 21.21,16.45 21.46,16.45 | 21.46,16.45 21.72,16.45 | 21.72,16.45 21.97,16.45 v22.1,16.57 | U2.4 21.46,16.23 | 21.46,16.23 21.46,16.44 21.46,16.45 | 21.46,16.23 21.43,16.23 21.21,16.45 | 21.46,16.23 21.5,16.23 21.72,16.45
  Top 0.305: U2.18 19.96,9.16 C5.2
  Top 0.61: C5.2 19.11,9.02 18.92,8.83 v18.92,8.95 18.92,7.43 C15.+ | C15.+ 17.6,6.1 D2.- D9.- | v22.1,16.57 22.73,17.21 C12.2 24.83,17.27 25.4,17.84 25.4,21.02 24.89,21.53 LIGHT-SENSOR.- | R4.2 25.02,10.86 26.04,11.87 v26.16,11.87 | R7.1 38.29,4.95 v38.23,5.02 | v17.78,5.27 C15.+ | R19.2 4.57,3.37 4.19,3.75 v4.19,9.08 4.19,11.48 J2.3
  Bottom 0.508: 21.84,16.83 v22.1,16.57
  Bottom 0.61: v22.1,16.57 23.11,16.57 26.16,13.53 v26.16,11.87 26.16,10.99 24.38,9.21 22.86,9.21 22.35,8.7 19.18,8.7 v18.92,8.95 18.54,8.57 14.99,8.57 12.83,10.73 8,10.73 6.99,11.75 6.97,11.75 J2.3 | VCC..T 16.51,15.3 18.29,17.08 21.59,17.08 21.84,16.83 | v17.78,5.27 18.03,5.02 v38.23,5.02 38.23,6.92 37.21,7.94 37.21,9.48 J3.3 | v4.19,9.08 4.19,9.72 VCC.T
VCC_1  (via drill 0.3 pad 0.64)
  Top 0.406: U1.19 32.37,9.09 33.27,8.19 C2.2
  Top 0.61: C2.2 33.84,7.75 34.42,8.32 C8.1 34.8,10.73 | 34.8,10.73 34.8,11.24 | 34.8,11.24 34.8,11.87 | 34.8,11.87 34.8,16.57 38.99,20.76 38.99,22.29 38.35,22.92 36.07,22.92 | RX.+ 35.62,22.48 | 35.62,22.48 35.62,22.61 | TX.+ 33.59,22.86 v33.66,22.92 35.18,22.92 | 35.18,22.92 36.07,22.92 | 35.62,22.48 35.18,22.92 | 35.62,22.48 36.07,22.92 | Q1.3 v20.83,22.16 | D2.+ v16,7.68 | v26.16,9.21 26.16,10.73 26.67,11.24 34.16,11.24 | 34.29,11.24 34.8,11.24 | 34.16,11.24 34.8,11.87 | 34.16,11.24 34.29,11.24 | 34.29,11.24 34.8,10.73
  Bottom 0.61: v20.83,22.16 32.89,22.16 v33.66,22.92 | v16,7.68 24.64,7.68 v26.16,9.21
VUSB  (via drill 0.3 pad 0.64)
  Top 0.61: D4.- 24.33,2.79 v24.26,2.86 | C6.1 24.7,3.37 | 24.7,3.37 24.7,3.3 v24.26,2.86 | U3.5 23.86,3.26 | 23.86,3.26 24.59,3.26 24.7,3.37 | 23.86,3.26 v24.26,2.86 | Q1.2 18.23,19.81 R11.1 17.53,19.37 17.08,18.92 v17.02,18.86 16.38,18.22 C18.2 15.88,18.1 14.61,16.83 U5.1 | F1.2 26.42,7.05 v26.16,6.79 v23.75,6.79 | K1.2 13.21,2.86 12.7,3.37 v12.7,5.02
  Bottom 0.61: v17.02,18.86 17.53,19.37 24.64,19.37 25.53,18.48 25.53,17.84 28.19,15.18 28.19,7.3 VUSB.T 26.42,7.05 v26.16,6.79 | 16.89,5.02 19.05,2.86 v24.26,2.86 | v23.75,6.79 17.27,6.79 16.64,6.16 16.64,5.52 | 16.89,5.02 16.64,5.02 | 16.64,5.02 16.13,5.02 | 16.13,5.02 v12.7,5.02 | 16.64,5.27 16.64,5.02 | 16.64,5.52 16.64,5.27 | 16.64,5.27 16.89,5.02 | 16.64,5.52 16.13,5.02
XTAL1
  Top 0.203: X3.1 21.27,17.52 19.96,16.21 U2.7
XTAL2
  Top 0.203: U2.8 19.46,16.93 18.87,17.52 X3.3
(copper drawn outside any net)
  shapes: Bottom circle x1

### Text on the board
Bottom: D
tPlace: INPUT | OUTPUT
bPlace: GND | VCC | D3 | VCC | D5 | SDA | VCC | Grove - Joint | SCL | v2.0 04/01/2015 | GND
tNames: CHRG | PWR